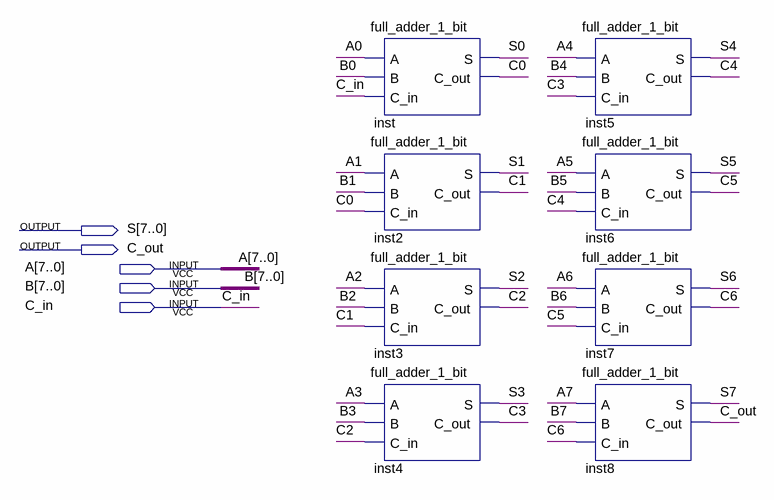
[diagram p0: schematic sheet]
// Quartus schematic full_adder_8_bit.bdf as structural Verilog: 8 symbols, 5 pins
module full_adder_8_bit (
  input  [7:0] A,
  input  [7:0] B,
  input  C_in,
  output [7:0] S,
  output C_out
);

  wire C0, C1, C2, C3, C4, C5, C6;

  full_adder_1_bit inst (.A(A[0]), .B(B[0]), .C_in(C_in), .S(S[0]), .C_out(C0));
  full_adder_1_bit inst2 (.A(A[1]), .B(B[1]), .C_in(C0), .S(S[1]), .C_out(C1));
  full_adder_1_bit inst3 (.A(A[2]), .B(B[2]), .C_in(C1), .S(S[2]), .C_out(C2));
  full_adder_1_bit inst4 (.A(A[3]), .B(B[3]), .C_in(C2), .S(S[3]), .C_out(C3));
  full_adder_1_bit inst5 (.A(A[4]), .B(B[4]), .C_in(C3), .S(S[4]), .C_out(C4));
  full_adder_1_bit inst6 (.A(A[5]), .B(B[5]), .C_in(C4), .S(S[5]), .C_out(C5));
  full_adder_1_bit inst7 (.A(A[6]), .B(B[6]), .C_in(C5), .S(S[6]), .C_out(C6));
  full_adder_1_bit inst8 (.A(A[7]), .B(B[7]), .C_in(C6), .S(S[7]), .C_out(C_out));
endmodule
